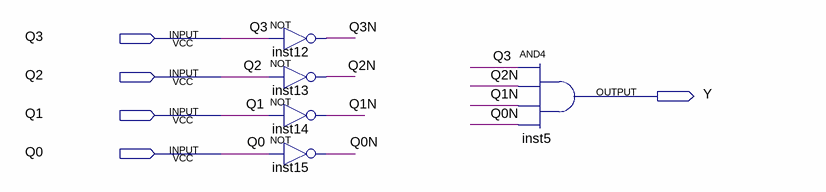
[diagram p0: schematic sheet]
// Quartus schematic Y.bdf as structural Verilog: 5 symbols, 5 pins
module Y (
  input  Q3,
  input  Q2,
  input  Q1,
  input  Q0,
  output Y
);

  wire Q0N, Q1N, Q2N, Q3N;

  not inst12 (Q3N, Q3);
  not inst13 (Q2N, Q2);
  not inst14 (Q1N, Q1);
  not inst15 (Q0N, Q0);
  and inst5 (Y, Q3, Q2N, Q1N, Q0N);
endmodule
